# EAGLE board FamicomBox+ (EAGLE 9.6.2)
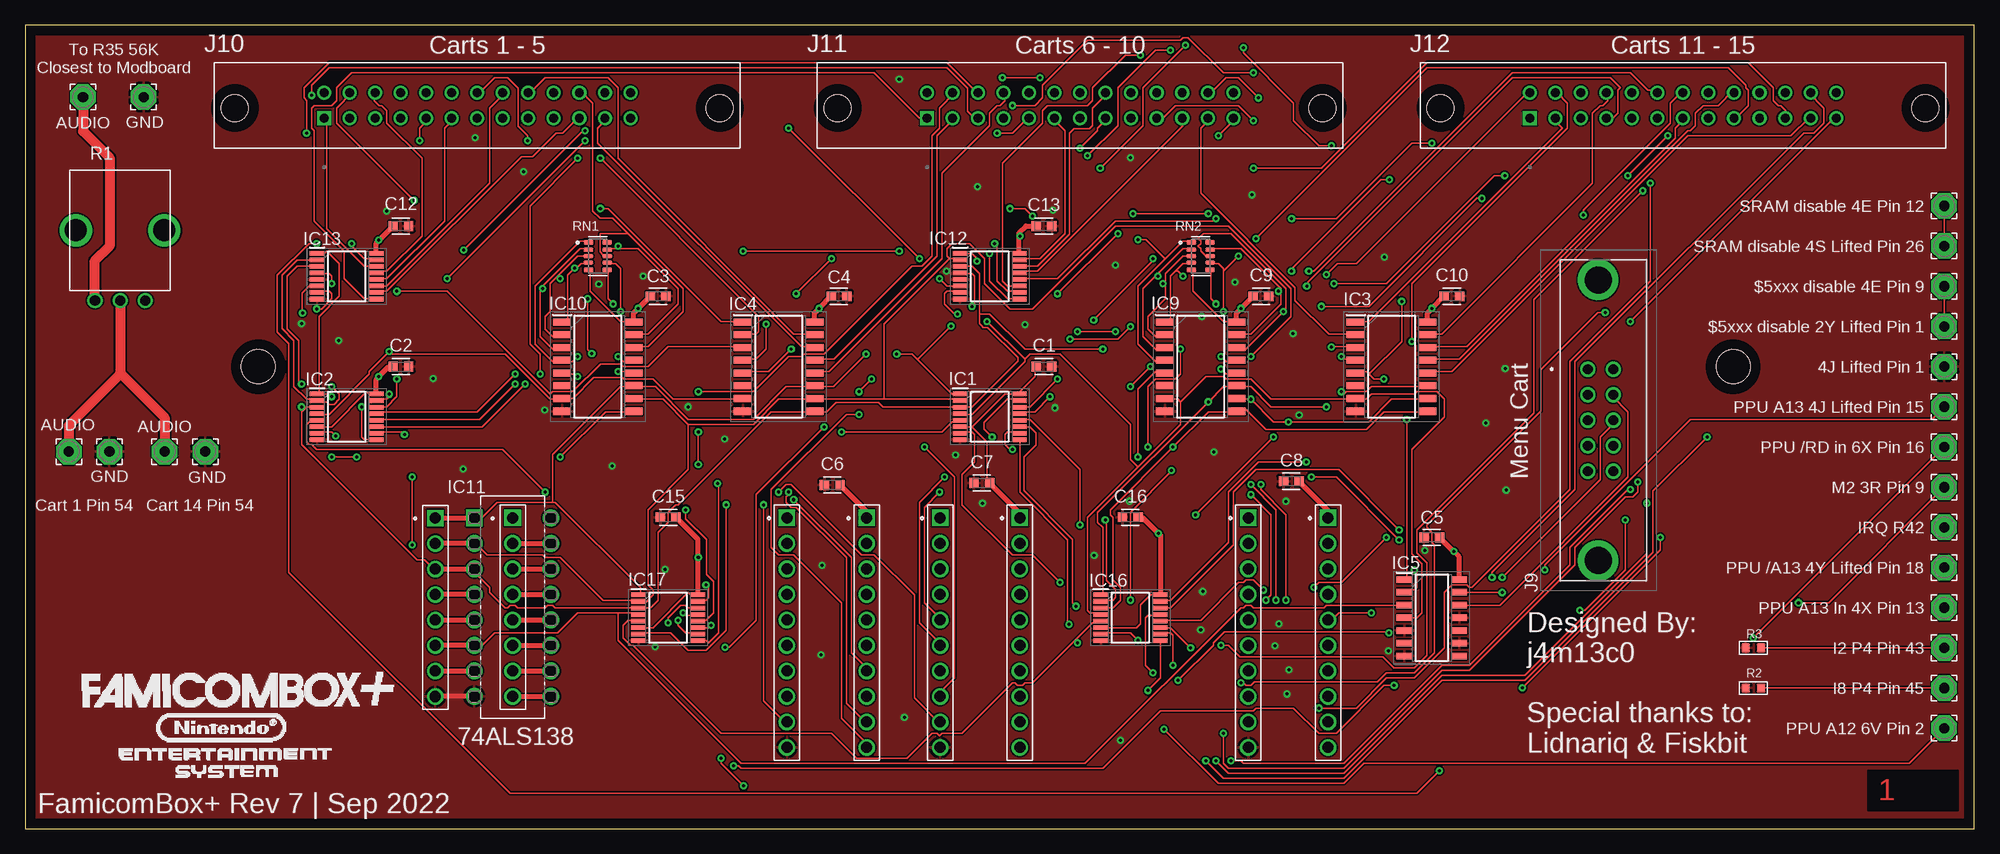
[diagram p1: board, top side]
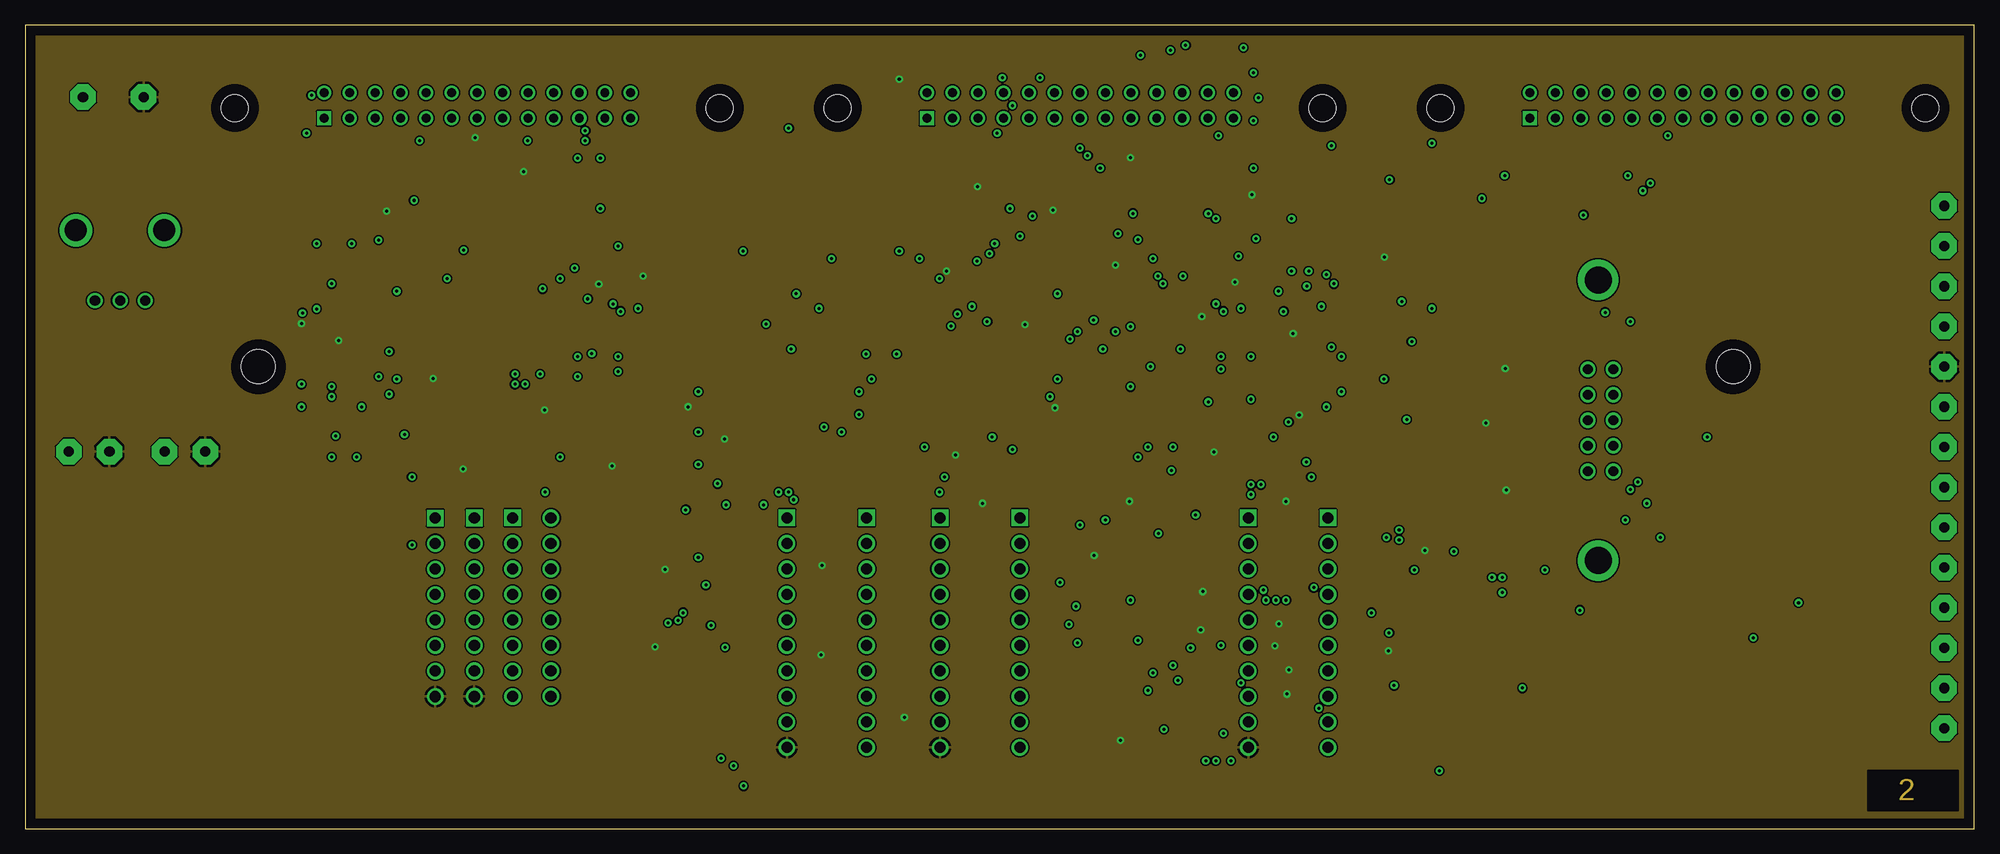
[diagram p2: board, inner layer Route2]
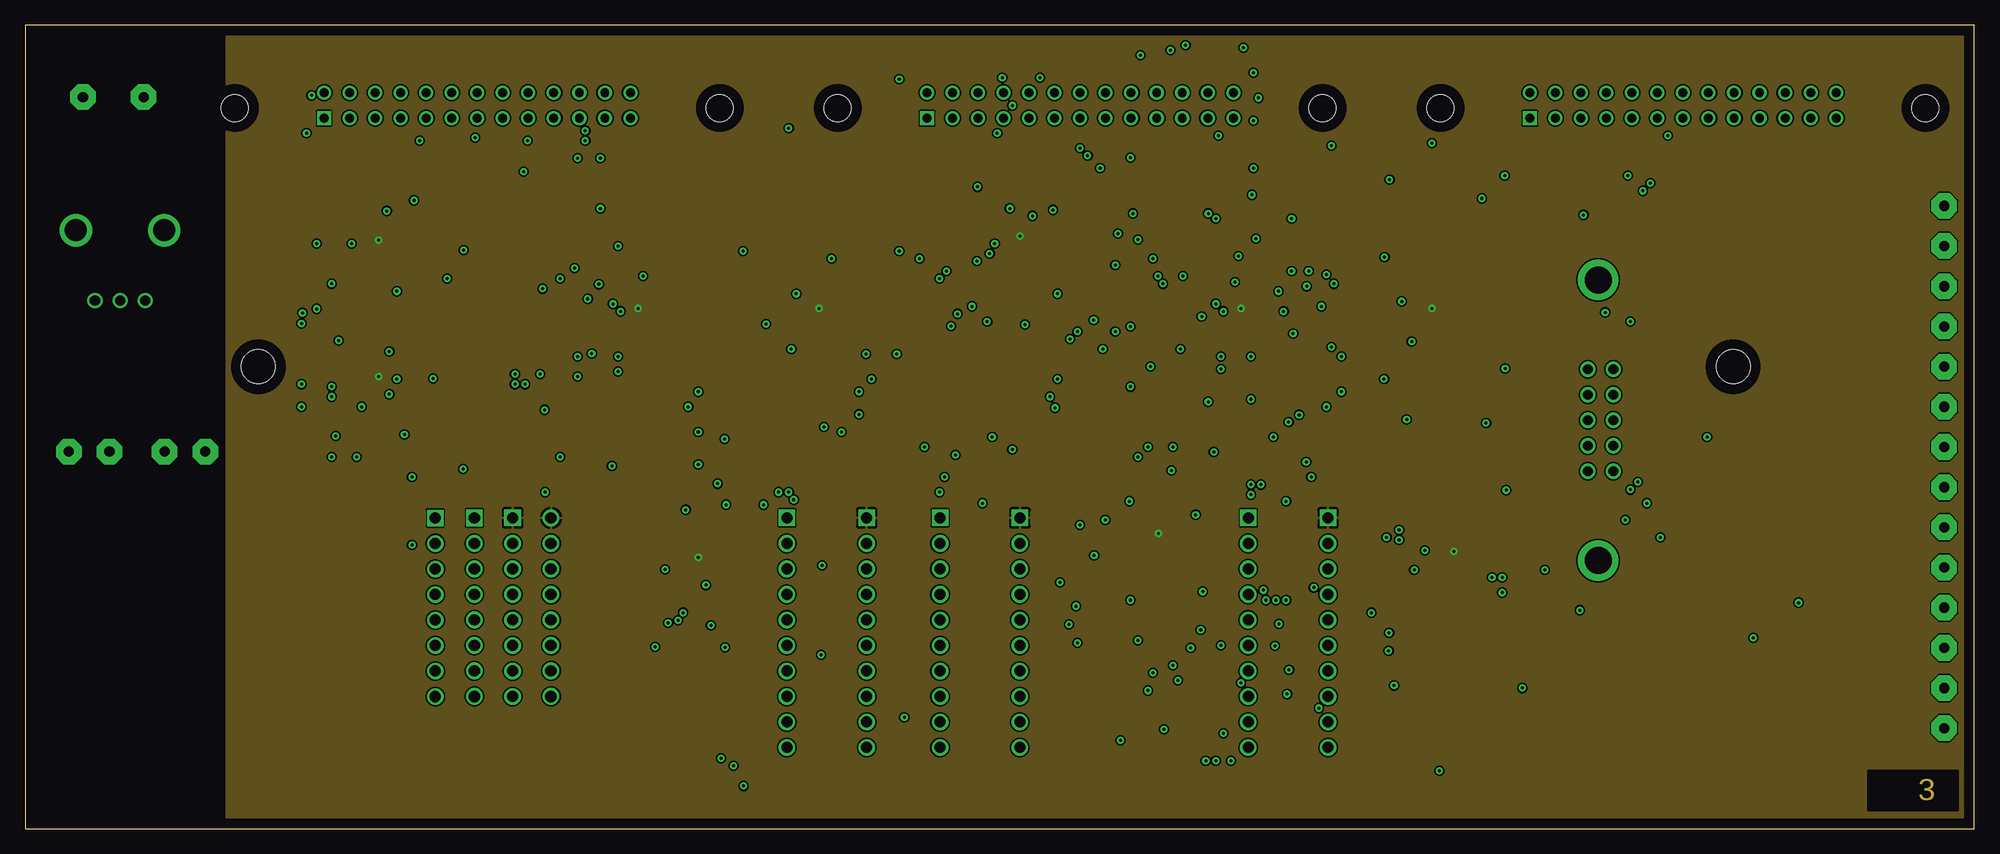
[diagram p3: board, inner layer Route15]
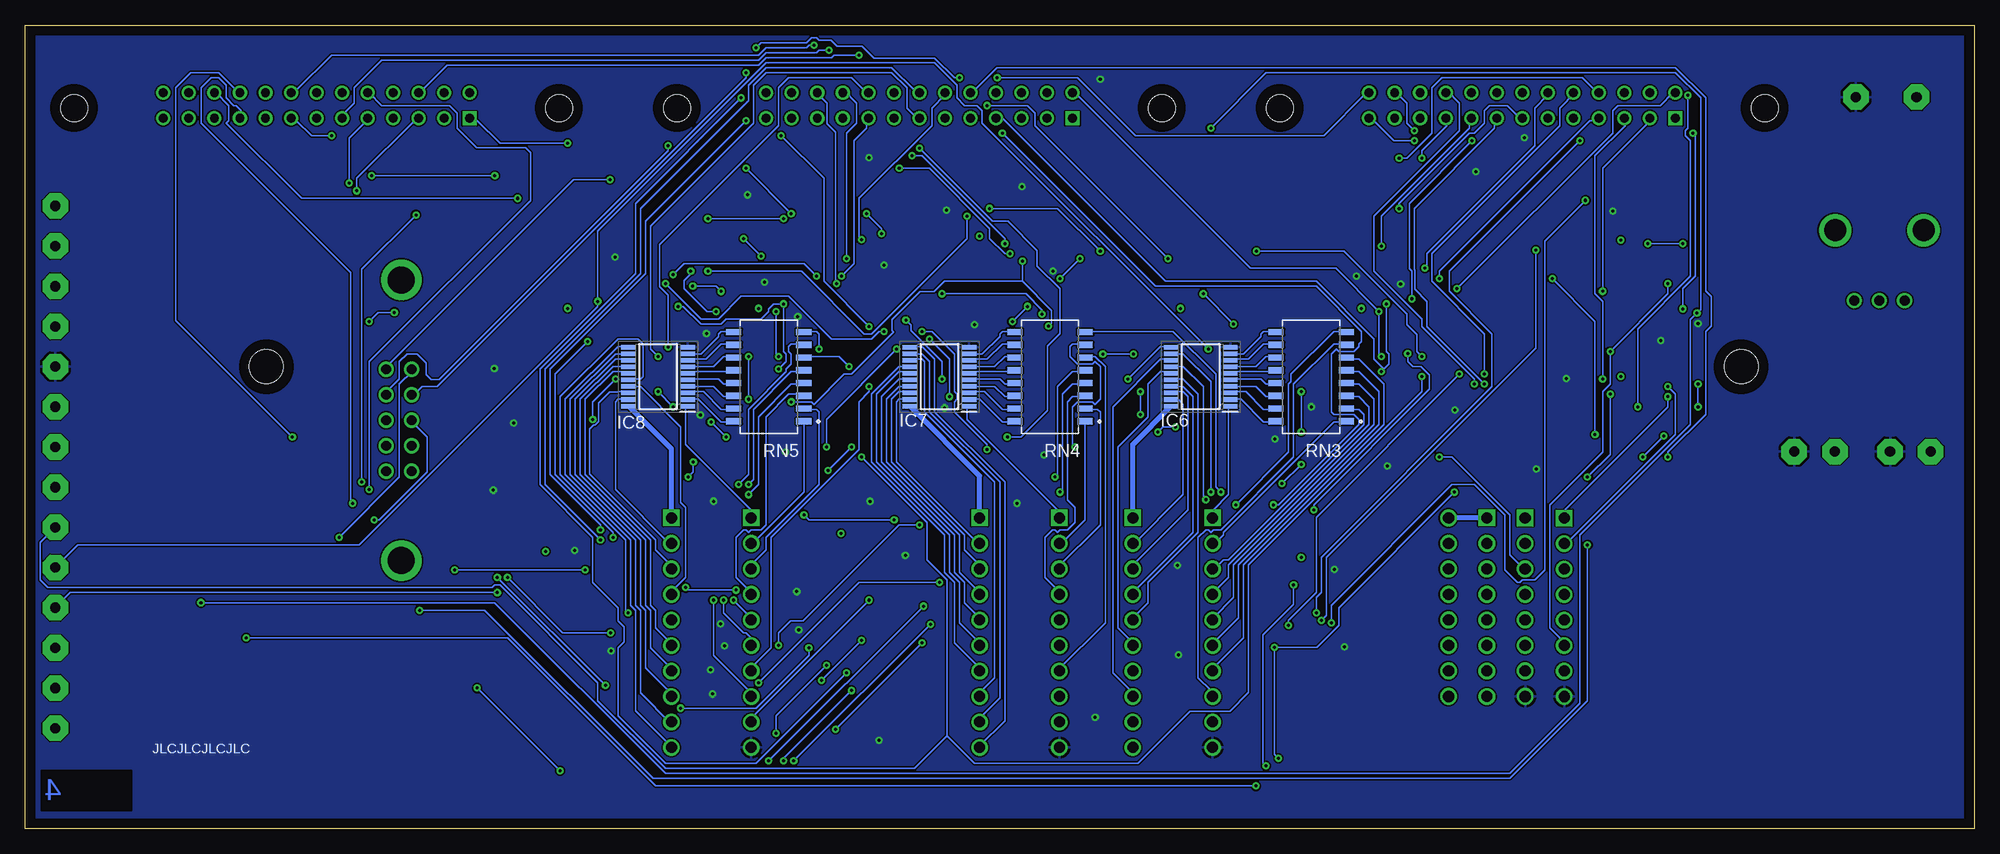
[diagram p4: board, bottom side, seen from below]

Size 194 x 80 mm. Coordinates in mm from the lower left corner, seen from the top.
Outline: 0,0 194,0 194,80 0,80 0,0
Copper layers (1*2+15*16): Top 0.035mm / dielectric 1.5mm / Route2 0.035mm / dielectric 0.15mm / Route15 0.035mm / dielectric 0.2mm / Bottom 0.035mm
Design rules "default *": minimum track width 6mil, minimum drill 0.3mm, track to track 6mil, track to pad 6mil, pad to pad 6mil, via to via 6mil, smd to smd 6mil, copper to edge 40mil, drill to drill 6mil, minimum pad ring 10mil, minimum via ring 8mil, stop-mask expansion 4mil, vias tented up to drill 0.3mm, thermal gap 10mil
Holes 3.4 mm at 23.2,46 170,46

## Footprints (pad centres in the part's own frame; a part is rotated, then mirrored left to right if it is on the bottom)
CAPC1608X85 = smd 0.921 x 0.97: 1 -0.775,0; 2 0.775,0
SOP65P640X110-16N = smd 1.475 x 0.45: 1 -2.938,2.275; 2 -2.938,1.625; 3 -2.938,0.975; 4 -2.938,0.325; 5 -2.938,-0.325; 6 -2.938,-0.975; 7 -2.938,-1.625; 8 -2.938,-2.275; 9 2.938,-2.275; 10 2.938,-1.625; 11 2.938,-0.975; 12 2.938,-0.325; 13 2.938,0.325; 14 2.938,0.975; 15 2.938,1.625; 16 2.938,2.275
SOIC127P780X200-16N = smd 1.825 x 0.7: 1 -3.562,4.445; 2 -3.562,3.175; 3 -3.562,1.905; 4 -3.562,0.635; 5 -3.562,-0.635; 6 -3.562,-1.905; 7 -3.562,-3.175; 8 -3.562,-4.445; 9 3.562,-4.445; 10 3.562,-3.175; 11 3.562,-1.905; 12 3.562,-0.635; 13 3.562,0.635; 14 3.562,1.905; 15 3.562,3.175; 16 3.562,4.445
SOIC127P600X175-14N = smd 1.55 x 0.65: 1 -2.725,3.81; 2 -2.725,2.54; 3 -2.725,1.27; 4 -2.725,0; 5 -2.725,-1.27; 6 -2.725,-2.54; 7 -2.725,-3.81; 8 2.725,-3.81; 9 2.725,-2.54; 10 2.725,-1.27; 11 2.725,0; 12 2.725,1.27; 13 2.725,2.54; 14 2.725,3.81
SOP65P640X120-20N = smd 1.475 x 0.45: 1 -2.938,2.925; 2 -2.938,2.275; 3 -2.938,1.625; 4 -2.938,0.975; 5 -2.938,0.325; 6 -2.938,-0.325; 7 -2.938,-0.975; 8 -2.938,-1.625; 9 -2.938,-2.275; 10 -2.938,-2.925; 11 2.938,-2.925; 12 2.938,-2.275; 13 2.938,-1.625; 14 2.938,-0.975; 15 2.938,-0.325; 16 2.938,0.325; 17 2.938,0.975; 18 2.938,1.625; 19 2.938,2.275; 20 2.938,2.925
DIP254P762X508-16 = drill 1.118 pad 1.676 square: 1 -7.62,17.78 | drill 1.118 pad 1.676: 2 -7.62,15.24; 3 -7.62,12.7; 4 -7.62,10.16; 5 -7.62,7.62; 6 -7.62,5.08; 7 -7.62,2.54; 8 -7.62,0; 9 0,0; 10 0,2.54; 11 0,5.08; 12 0,7.62; 13 0,10.16; 14 0,12.7; 15 0,15.24; 16 0,17.78
SOP65P640X120-16N = smd 1.475 x 0.45: 1 -2.938,2.275; 2 -2.938,1.625; 3 -2.938,0.975; 4 -2.938,0.325; 5 -2.938,-0.325; 6 -2.938,-0.975; 7 -2.938,-1.625; 8 -2.938,-2.275; 9 2.938,-2.275; 10 2.938,-1.625; 11 2.938,-0.975; 12 2.938,-0.325; 13 2.938,0.325; 14 2.938,0.975; 15 2.938,1.625; 16 2.938,2.275
61300811121 = drill 1.1 square: 1 -8.89,0 | drill 1.1: 2 -6.35,0; 3 -3.81,0; 4 -1.27,0; 5 1.27,0; 6 3.81,0; 7 6.35,0; 8 8.89,0
61301011121 = drill 1.1 square: 1 -11.43,0 | drill 1.1: 2 -8.89,0; 3 -6.35,0; 4 -3.81,0; 5 -1.27,0; 6 1.27,0; 7 3.81,0; 8 6.35,0; 9 8.89,0; 10 11.43,0
254992061 = drill 0.97 pad 1.509: 1 0,0; 2 0,2.54; 3 2.54,0; 4 2.54,2.54; 5 5.08,0; 6 5.08,2.54; 7 7.62,0; 8 7.62,2.54; 9 10.16,0; 10 10.16,2.54 | drill 2.69 pad 4.035: MH1 -8.89,1.02; MH2 19.05,1.02
TE_2-5499206-6 = drill 0.89 square: 1 -15.24,-1.27 | drill 0.89: 2 -15.24,1.27; 3 -12.7,-1.27; 4 -12.7,1.27; 5 -10.16,-1.27; 6 -10.16,1.27; 7 -7.62,-1.27; 8 -7.62,1.27; 9 -5.08,-1.27; 10 -5.08,1.27; 11 -2.54,-1.27; 12 -2.54,1.27; 13 0,-1.27; 14 0,1.27; 15 2.54,-1.27; 16 2.54,1.27; 17 5.08,-1.27; 18 5.08,1.27; 19 7.62,-1.27; 20 7.62,1.27; 21 10.16,-1.27; 22 10.16,1.27; 23 12.7,-1.27; 24 12.7,1.27; 25 15.24,-1.27; 26 15.24,1.27 | hole 2.69: -24.13,-0.25; 24.13,-0.25
2,54/1,0 = drill 1.016 pad 2.54 octagon: 1 0,0
PTV09 = drill 1: 1 -2.5,0; 2 0,0; 3 2.5,0 | drill 2.2: NC1 -4.4,7; NC2 4.4,7
R0603 = smd 0.889 x 0.889: 1 0,0.762; 2 0,-0.762
RESCAXS64P320X160X60-10N = smd 0.97 x 0.54: 1 -0.94,1.365; 5 -0.94,-1.365; 6 0.94,-1.365; 10 0.94,1.365 | smd 0.97 x 0.37: 2 -0.94,0.64; 3 -0.94,0; 4 -0.94,-0.64; 7 0.94,-0.64; 8 0.94,0; 9 0.94,0.64
SOIC127P762X240-16N = smd 1.59 x 0.6: 1 -3.495,4.445; 2 -3.495,3.175; 3 -3.495,1.905; 4 -3.495,0.635; 5 -3.495,-0.635; 6 -3.495,-1.905; 7 -3.495,-3.175; 8 -3.495,-4.445; 9 3.495,-4.445; 10 3.495,-3.175; 11 3.495,-1.905; 12 3.495,-0.635; 13 3.495,0.635; 14 3.495,1.905; 15 3.495,3.175; 16 3.495,4.445

## Placement (x,y rotation side)
C1  100nF  [CAPC1608X85]  101.4,46 180 top
C2  100nF  [CAPC1608X85]  37.4,46 180 top
C3  100nF  [CAPC1608X85]  63,53 180 top
C4  100nF  [CAPC1608X85]  81,53 180 top
C5  100nF  [CAPC1608X85]  140,29 0 top
C6  100nF  [CAPC1608X85]  80.32,34.23 0 top
C7  100nF  [CAPC1608X85]  95.22,34.41 0 top
C8  100nF  [CAPC1608X85]  126.02,34.59 0 top
C9  100nF  [CAPC1608X85]  123,53 180 top
C10  100nF  [CAPC1608X85]  142,53 180 top
C12  100nF  [CAPC1608X85]  37.4,60 180 top
C13  100nF  [CAPC1608X85]  101.4,60 180 top
C15  100nF  [CAPC1608X85]  64,31 0 top
C16  100nF  [CAPC1608X85]  110,31 0 top
IC1  74HC138PW,118  [SOP65P640X110-16N]  96,41 0 top
IC2  74HC138PW,118  [SOP65P640X110-16N]  32,41 0 top
IC3  SN74HC251NSR  [SOIC127P780X200-16N]  136,46 0 top
IC4  SN74HC251NSR  [SOIC127P780X200-16N]  75,46 0 top
IC5  MC74HC04ADG  [SOIC127P600X175-14N]  140,21 0 top
IC6  SN74CBT3245APWR  [SOP65P640X120-20N]  77,45 180 bottom
IC7  SN74CBT3245APWR  [SOP65P640X120-20N]  103,45 180 bottom
IC8  SN74CBT3245APWR  [SOP65P640X120-20N]  131,45 180 bottom
IC9  SN74HC251NSR  [SOIC127P780X200-16N]  117,46 0 top
IC10  SN74HC251NSR  [SOIC127P780X200-16N]  57,46 0 top
IC11  SN74ALS138AN  [DIP254P762X508-16]  52.33,13.16 0 top
IC12  CD74HC238PWR  [SOP65P640X120-16N]  96,55 0 top
IC13  CD74HC238PWR  [SOP65P640X120-16N]  32,55 0 top
IC16  74HC138PW,118  [SOP65P640X110-16N]  110,21 0 top
IC17  74HC138PW,118  [SOP65P640X110-16N]  64,21 0 top
J1  61300811121  [61300811121]  40.82,22.04 270 top
J2  61300811121  [61300811121]  48.52,22.05 270 top
J3  61301011121  [61301011121]  75.82,19.51 270 top
J4  61301011121  [61301011121]  83.76,19.51 270 top
J5  61301011121  [61301011121]  91.06,19.51 270 top
J6  61301011121  [61301011121]  99,19.51 270 top
J7  61301011121  [61301011121]  121.74,19.51 270 top
J8  61301011121  [61301011121]  129.68,19.51 270 top
J9  2-5499206-1  [254992061]  155.54,45.74 270 top
J10  2-5499206-6  [TE_2-5499206-6]  45,72 0 top
J11  2-5499206-6  [TE_2-5499206-6]  105,72 0 top
J12  2-5499206-6  [TE_2-5499206-6]  165,72 0 top
PAD1  WIREPAD2,54/1,0  [2,54/1,0]  191,46 0 top
PAD2  WIREPAD2,54/1,0  [2,54/1,0]  191,34 0 top
PAD3  WIREPAD2,54/1,0  [2,54/1,0]  191,30 0 top
PAD4  WIREPAD2,54/1,0  [2,54/1,0]  191,26 0 top
PAD5  WIREPAD2,54/1,0  [2,54/1,0]  191,42 0 top
PAD6  WIREPAD2,54/1,0  [2,54/1,0]  191,22 0 top
PAD7  WIREPAD2,54/1,0  [2,54/1,0]  191,18 0 top
PAD8  WIREPAD2,54/1,0  [2,54/1,0]  191,14 0 top
PAD9  WIREPAD2,54/1,0  [2,54/1,0]  191,62 0 top
PAD10  WIREPAD2,54/1,0  [2,54/1,0]  191,58 0 top
PAD11  WIREPAD2,54/1,0  [2,54/1,0]  191,54 0 top
PAD12  WIREPAD2,54/1,0  [2,54/1,0]  191,50 0 top
PAD13  WIREPAD2,54/1,0  [2,54/1,0]  191,38 0 top
PAD14  WIREPAD2,54/1,0  [2,54/1,0]  11.79,72.83 0 top
PAD15  WIREPAD2,54/1,0  [2,54/1,0]  5.76,72.83 0 top
PAD16  WIREPAD2,54/1,0  [2,54/1,0]  4.34,37.54 0 top
PAD17  WIREPAD2,54/1,0  [2,54/1,0]  13.88,37.54 0 top
PAD18  WIREPAD2,54/1,0  [2,54/1,0]  17.93,37.54 0 top
PAD19  WIREPAD2,54/1,0  [2,54/1,0]  8.39,37.54 0 top
PAD20  WIREPAD2,54/1,0  [2,54/1,0]  191,10 0 top
R1  PTV09A-4020F-A504  [PTV09]  9.45,52.58 0 top
R2  1.5K  [R0603]  172,14 270 top
R3  1.5K  [R0603]  172,18 270 top
RN1  CAY17-103JALF  [RESCAXS64P320X160X60-10N]  57,57 0 top
RN2  CAY17-103JALF  [RESCAXS64P320X160X60-10N]  117,57 0 top
RN3  4816P-1-562LF  [SOIC127P762X240-16N]  66,45 180 bottom
RN4  4816P-1-562LF  [SOIC127P762X240-16N]  92,45 180 bottom
RN5  4816P-1-562LF  [SOIC127P762X240-16N]  120,45 180 bottom

## Tracks (layer width: path | path; a pad name or v marks a point on that pad's centre or on a via)
/CAS3  (via drill 0.3)
  Top 0.152: IC5.4 138.5,21 139,21.5 139,26.35 138,27.35 138,37.75 141.25,41 141.25,42.75 140.5,43.5 138.5,43.5 138.25,43.25 134,43.25 133.5,42.75 132.5,42.75 IC3.7 132.25,42.75 124,42.75 122,44.75 119.5,44.75 119.25,45 117.5,45 115,42.5 | 110.75,36 115,40.25 115,42.5 | 110.75,36 105.75,31 105.75,21.75 106,21.5 107,21.5 IC16.4 | 115,42.5 114.75,42.75 113.5,42.75 IC9.7 | 99.5,46.75 99.5,46.5 94.25,41.25 93.25,41.25 IC1.4 | 99.5,46.75 100,47.25 103,47.25 110,40.25 110,36.75 110.75,36 | v94.25,52 94.5,52.25 94.5,55 94.25,55.25 93.25,55.25 IC12.4 | 99.5,46.75 v95.75,50.5
  Bottom 0.152: v95.75,50.5 v94.25,52
CAS0  (via drill 0.3)
  Top 0.152: IC16.1 107.25,23.25 107.25,30 106.75,30.5 106.75,31.5 v117.75,42.5 119.25,44 120.5,44 IC9.11 120.75,44 122,44 124,42 v129.5,42 | v131,43.5 131.25,43.25 131.5,43.5 133.5,43.5 134,44 139.5,44 IC3.11 | 88.8,46.7 88.25,47.25 v86.75,47.25 | 88.8,46.7 92.25,43.25 93,43.25 IC1.1 | v83.7,47.25 80.45,44 78.75,44 IC4.11 78.5,44 75.75,44 72.5,40.75 66,40.75 62.75,44 60.75,44 IC10.11 60.5,44 59.25,44 52.5,37.25 52.5,32.5 | v94.75,56.5 94.75,56.75 94.25,57.25 93.25,57.25 IC12.1 | 88.8,46.7 v92.15,50.05 | 29.25,43.25 29.25,51 31.25,53 31.25,56.25 30,57.5 29.75,57.25 29.25,57.25 IC13.1 | 52.5,32.5 47,32.5 45.5,31 44.75,31 IC11.1 | 52.5,32.5 52.75,32.5 61.25,24 61.25,23.25 IC17.1 | 29.25,43.25 30.25,43.25 v30.5,43 | 29.25,43.25 IC2.1
  Top 0.508: J1.1 IC11.1
  Bottom 0.152: v129.5,42 v131,43.5 | v83.7,47.25 v86.75,47.25 | 94.75,54.5 v94.75,56.5 | 94.75,54.5 91.85,51.6 91.85,50.35 v92.15,50.05 | v30.5,43 30.5,42 40.75,31.75 40.75,31 J1.1 | v117.75,42.5 115.75,42.5 115.5,42.25 112.5,45.25 111.75,45.25 107.55,49.45 107.7,49.6 107.7,50.7 104.95,53.45 103.55,53.45 102.5,54.5 94.75,54.5
CAS1  (via drill 0.3)
  Top 0.152: v124.25,39 v116.5,31.25 | IC16.2 107.25,22.75 108.25,22.75 108.5,23 108.5,23.8 107.6,24.7 107.6,30.65 v107.5,30.75 | IC9.10 120.75,42.75 v122,42.75 124.25,40.5 v125.75,40.5 133.75,40.5 136,42.75 139.5,42.75 IC3.10 | 85.5,42.75 78.75,42.75 IC4.10 78.5,42.75 75,42.75 72.5,40.25 66,40.25 | 85.5,42.75 93,42.75 IC1.2 | 92,56.75 93,56.75 IC12.2 | 92,56.75 85.5,50.25 85.5,42.75 | 66,40.25 63.5,42.75 60.75,42.75 IC10.10 | IC11.2 44.75,28.5 46,27.25 51.5,27.25 51.75,27 53.25,27 57.5,22.75 61,22.75 IC17.2 61.25,22.5 61.75,22.5 62.5,23.25 62.5,23.75 62,24.25 62,31.75 66,35.75 66,40.25 | v30.5,44 31.25,43.25 31.25,42.75 30.75,42.25 30.25,42.25 30,42.5 29.25,42.5 IC2.2 29,42.75 28,42.75 26.75,44 26.75,48.6 25.57,49.78 25.57,55.13 27.06,56.62 IC13.2 | v122,47 126,51 126,53.75 119.75,60 108.5,60 100.25,51.75 98,51.75 95.5,54.25 95.5,56.75 94,58.25 92.25,58.25 91.75,57.75 91.75,57 92,56.75
  Top 0.508: IC11.2 J1.2
  Bottom 0.152: v107.5,30.75 116,30.75 v116.5,31.25 | v125.75,40.5 v124.25,39 | v30.5,44 29.75,43.25 29.75,39.25 40.75,28.25 J1.2 | v122,47 v122,42.75
CAS2  (via drill 0.3)
  Top 0.152: IC16.3 107.25,22 108.25,22 109,22.75 109,24 108.25,24.75 108.25,31 108,31.25 108,31.75 v114.25,38 117.75,41.5 120.5,41.5 IC9.9 120.75,41.75 121.5,41.75 123.5,39.75 133.5,39.75 135.25,41.5 139.5,41.5 IC3.9 | 95,51.25 95,50.3 95.3,50 95.3,49.9 95.8,49.9 98.8,46.9 98.8,46.55 94.25,42 93.25,42 IC1.3 93,42 85.4,42 84.95,42.44 80.69,42.44 79.75,41.5 78.75,41.5 IC4.9 78.5,41.5 74.25,41.5 65,32.25 64.75,32.25 64,31.5 64,30.5 63,29.5 63,22.75 62.25,22 61.25,22 IC17.3 61,22 52.75,22 52.5,22.25 52,22.25 51.75,22 49,22 48.75,22.25 48.25,22.25 48,22 47.75,22 46.25,23.5 46.25,24 44.5,25.75 IC11.3 | 95,51.25 95,55.25 94.25,56 93.25,56 IC12.3 | 27.75,41.75 27.5,41.5 27.5,38.25 39,26.75 39.75,26.75 40.75,25.75 J1.3 | 27.75,41.75 28,42 29,42 IC2.3 | v27.5,44.25 27.25,44.5 27.25,48.6 26.1,49.75 26.1,55 27.1,56 29,56 IC13.3 | 27.75,41.75 v27.5,42 | v53.25,37 57.75,41.5 60.5,41.5 IC10.9 | v107.25,47.75 99.5,47.75 96,51.25 95,51.25
  Top 0.508: J1.3 IC11.3
  Bottom 0.152: v27.5,42 v27.5,44.25 | v53.25,37 52,37 46.25,31.25 46.25,27.25 44.75,25.75 IC11.3 | v114.25,38 114.25,40.75 v107.25,47.75
CAS3  (via drill 0.3)
  Top 0.152: 36.25,47.25 47.75,47.25 52.25,42.75 53.25,42.75 IC10.7 54.52,42.83 56.6,44.9 59.44,44.9 59.59,44.75 62.5,44.75 64.5,42.75 71.25,42.75 IC4.7 | 36.25,47.25 36,47.25 34.25,45.5 34.25,45.25 30.25,41.25 29.25,41.25 IC2.4 | v30.5,54.25 30.5,55 30.25,55.25 29.25,55.25 IC13.4 | 36.25,47.25 v36.25,47.5 | 59,21.5 55,21.5 53,19.5 46.75,19.5 45.5,18.25 44.75,18.25 IC11.6 | 59,21.5 61,21.5 IC17.4 | 59,21.5 59,18.75 71.25,6.5 105.5,6.5 121,22 121.25,22 121.5,22.25 122,22.25 122.25,22 129.25,22 129.5,22.25 137.25,22.25 IC5.3
  Top 0.508: IC11.6 J1.6
  Bottom 0.152: v30.5,54.25 30.5,53.25 v36.25,47.5 36.25,44.25 37,43.5 37,37.5 42.25,32.25 42.25,20 41,18.75 41,18.25 J1.6
CUTOUT
  cutout Top: 183.4,5.8 183.4,1.8 192.4,1.8 192.4,5.8
  cutout Route2: 183.4,5.8 183.4,1.8 192.4,1.8 192.4,5.8
  cutout Route15: 183.4,5.8 183.4,1.8 192.4,1.8 192.4,5.8
  cutout Bottom: 183.4,5.8 183.4,1.8 192.4,1.8 192.4,5.8
GND  (via drill 0.3)
  Top 0.508: IC11.8 J1.8
  other vias: 106.4,27.2 117.2,23.6 117,19.8 109,8.8 125.6,13.4 125.8,15.8 124.4,18.2 124.8,20.4 147.3,45.8 145.4,40.4 147.4,33.7 122.1,63.1 94.8,63.9 87,74.6 49.6,65.4 57.1,54.2 58.4,36.1 43.6,35.8 40.6,44.8 31.2,48.6 87.5,11.1 79.2,17.3 63.7,25.8 79.3,26.2 91.7,55.5 108.5,56.1 102.5,41.9 92.6,37.2 139.3,27.7 99.5,50.2 95.3,32.4 27.5,50.3 126.2,49.3 125.5,32.6 36,61.5 126.8,41.2 69.6,38.8 62.7,18.1 102.3,61.6 51.7,41.7 61.5,55 109.9,32.6 120.4,54.4 66,42 135.3,56.9 110,66.8 118.3,37.5 135.7,17.7 117.1,51 44.8,68.8
  pour Top: 0.3,79.7 193.7,79.7 193.7,0.3 0.3,0.3
  pour Bottom: 0.3,79.7 193.7,79.7 193.7,0.3 0.3,0.3
  pour Route2: 0.3,79.7 193.7,79.7 193.7,0.3 0.3,0.3
IRQ_OUT  (via drill 0.3)
  Top 0.152: v55,45 54.75,45.25 53.5,45.25 IC10.5 | v110.75,37 110.75,43.75 112.5,45.5 113.25,45.5 IC9.5
  Bottom 0.152: v55,45 55,43.5 72.25,26.25 72.25,13.55 74.1,11.7 78.05,11.7 83.25,6.5 99.5,6.5 102.25,9.25 | 102.25,9.25 102.25,24.75 104.25,26.75 104.25,30.5 v110.75,37 | PAD3.1 192.5,28.5 192.5,24.75 191.75,24 147.5,24 147.25,24.25 146.75,24.25 137,14.5 137,12.75 130.25,6 105.5,6 102.25,9.25
M2_IN  (via drill 0.3)
  Top 0.152: v27.6,51.35 27.55,51.4 27.55,53.3 28.25,54 29,54 IC13.6 | v89,56.75 v76,69.75 | v91,54.75 91.75,54 93,54 IC12.6 | PAD2.1 179.5,22.5 v176.5,22.5
  Bottom 0.152: v76,69.75 70.5,75.25 29.75,75.25 27.25,72.75 27.25,51.7 v27.6,51.35 28.25,50.7 28.25,40.25 39.25,29.25 39.25,12.5 46.25,5.5 130.25,5.5 147.25,22.5 v176.5,22.5 | v91,54.75 v89,56.75
N$1
  Bottom 0.152: IC6.2 74,42.75 73,42.75 70.75,40.5 69.5,40.5 RN3.16
N$2
  Bottom 0.152: IC6.3 74,43.5 72.5,43.5 70.75,41.75 69.5,41.75 RN3.15
N$3
  Bottom 0.152: IC6.4 74,44 71.5,44 70.5,43 69.5,43 RN3.14
N$4
  Bottom 0.152: IC6.5 74,44.75 71,44.75 70.5,44.25 69.5,44.25 RN3.13
N$5
  Bottom 0.152: IC6.6 74,45.5 69.5,45.5 RN3.12
N$6
  Bottom 0.152: IC6.7 74,46 71.5,46 70.5,47 69.5,47 RN3.11
N$7
  Bottom 0.152: IC6.8 74,46.75 72.25,46.75 70.75,48.25 69.5,48.25 RN3.10
N$8
  Bottom 0.152: IC6.9 74,47.25 72.75,47.25 71,49 71,49.25 70.75,49.5 69.5,49.5 RN3.9
N$9
  Bottom 0.152: RN3.1 62.75,40.5 63.75,40.5 74.75,29.5 74.75,29.25 75.75,28.25 J3.2
N$10
  Bottom 0.152: RN3.2 62.5,41.75 61.25,41.75 60.75,41.25 60.75,40.25 74.25,26.75 74.75,26.75 75.75,25.75 J3.3
N$11  (via drill 0.3)
  Top 0.152: v83,43.5 v84.25,44.75 | v83,41.25 81.75,41.25 74.25,33.75 74.25,28 75,27.25 76.5,27.25 81.25,22.5 81.25,11 84,8.25 J4.10
  Bottom 0.152: v84.25,44.75 81,48 80,48 IC6.11 | v83,41.25 v83,43.5
N$12  (via drill 0.3)
  Top 0.152: v76,33.5 76,33.25 75.75,33 75.75,32.5 76.25,32 76.75,32 81.75,27 81.75,12.5 83.75,10.5 J4.9
  Bottom 0.152: v76,33.5 76,44.5 78.75,47.25 79.75,47.25 IC6.12
N$13
  Bottom 0.152: IC6.13 80,46.75 81,46.75 85.75,42 85.75,15.5 84,13.75 84,13.25 J4.8
N$14  (via drill 0.3)
  Top 0.152: v76.5,32.75 82.25,27 82.25,17.5 84,15.75 J4.7
  Bottom 0.152: v76.5,32.75 76.75,33 76.75,44 78.75,46 79.75,46 IC6.14
N$15
  Bottom 0.152: IC6.15 80,45.5 81,45.5 82.25,44.25 82.25,41 85.25,38 85.25,20 84,18.75 84,18.25 J4.6
N$16
  Bottom 0.152: IC6.16 79.75,44.75 78.75,44.75 77.25,43.25 77.25,29.5 82.25,24.5 82.25,22.5 83.75,21 J4.5
N$17
  Bottom 0.152: IC6.17 79.75,44 78.75,44 77.75,43 77.75,29.5 83.75,23.5 J4.4
N$18
  Bottom 0.152: IC6.18 79.75,43.5 78.75,43.5 78.25,43 78.25,31.75 84,26 J4.3
N$19
  Bottom 0.152: IC6.19 79.75,42.75 79.25,42.75 78.75,42.25 78.75,33.25 83.75,28.25 J4.2
N$20
  Bottom 0.152: RN3.3 62.5,43 61.25,43 60.25,42 60.25,40.25 74.25,26.25 74.25,25 75.75,23.5 J3.4
N$21
  Bottom 0.152: RN3.4 62.5,44.25 61.25,44.25 59.75,42.75 59.75,40.25 73.75,26.25 73.75,23 75.75,21 J3.5
N$22
  Bottom 0.152: RN3.5 62.5,45.5 61.25,45.5 59.25,43.5 59.25,40.25 73.25,26.25 73.25,21 76,18.25 J3.6
N$23
  Bottom 0.152: RN3.6 62.5,46.75 61.25,46.75 58.75,44.25 58.75,40.25 72.75,26.25 72.75,19 76,15.75 J3.7
N$24
  Bottom 0.152: RN3.7 62.75,48.25 63.75,48.25 67.75,44.25 67.75,37 75,29.75 75.75,29.75 76,29.5 76.25,29.75 76.5,29.75 77.25,29 77.25,15 76,13.75 76,13.25 J3.8
N$25  (via drill 0.3)
  Top 0.152: v73.5,32.25 73.5,12.75 75.75,10.5 J3.9
  Bottom 0.152: v73.5,32.25 68.25,37.5 68.25,44.25 68,44.5 68,45.25 63.75,49.5 62.75,49.5 RN3.8
N$26
  Bottom 0.152: IC6.1 74.25,42 74.25,33.25 75.75,31.75 75.75,31 J3.1
N$27
  Bottom 0.152: RN5.1 116.5,40.5 116.5,33.5 121.5,28.5 J7.2
N$29
  Bottom 0.152: IC7.11 105.75,48 104.75,48 103.5,46.75 103.5,41.5 96.5,34.5 96.5,10.75 99,8.25 J6.10
N$30
  Bottom 0.152: J6.9 99,11 97,13 97,34.5 104,41.5 104,46.5 104.75,47.25 105.75,47.25 IC7.12
N$31
  Bottom 0.152: J6.8 99,13.5 97.5,15 97.5,34.5 104.5,41.5 104.5,46.5 104.75,46.75 105.75,46.75 IC7.13
N$32
  Bottom 0.152: J6.7 99,16 101.5,18.5 101.5,24.5 102.5,25.5 102.5,29.25 109.75,36.5 109.75,43.25 107,46 106,46 IC7.14
N$33
  Bottom 0.152: J6.6 99,18.5 101,20.5 101,24.5 102,25.5 102,29.25 109.25,36.5 109.25,43.25 107,45.5 106,45.5 IC7.15
N$34
  Bottom 0.152: IC7.16 106,44.75 107,44.75 108.75,43 108.75,36.5 101.5,29.25 101.5,25.5 100.5,24.5 100.5,22.5 99,21 J6.5
N$35
  Bottom 0.152: IC7.17 106,44 107,44 108.25,42.75 108.25,36.5 101,29.25 101,25.5 99,23.5 J6.4
N$36
  Bottom 0.152: J6.3 99,26.25 100.5,27.75 100.5,29.25 107.75,36.5 107.75,42.75 107,43.5 106,43.5 IC7.18
N$37
  Bottom 0.152: IC7.19 106,42.75 107,42.75 107.25,42.5 107.25,36.5 99,28.25 J6.2
N$38
  Bottom 0.152: IC8.19 134,42.75 135,42.75 135.25,42.5 135.25,33.75 129.75,28.25 J8.2
N$39
  Bottom 0.152: IC8.18 134,43.5 135,43.5 135.05,43.45 135.85,43.45 136.9,42.4 136.9,40.53 137.26,40.17 137.43,40.17 137.8,39.8 137.8,35.3 131.25,28.75 131.25,27.75 129.5,26 J8.3
N$40
  Bottom 0.152: IC8.17 133.75,44 132.75,44 128.75,40 128.75,32.5 128.25,32 128.25,25 129.75,23.5 J8.4
N$41  (via drill 0.3)
  Top 0.152: v134,21.5 130.75,21.5 130.25,21 129.75,21 J8.5
  Bottom 0.152: v134,21.5 134.25,21.75 134.25,28.75 140.75,35.25 140.75,43 135,48.75 133,48.75 132.5,48.25 132.5,45 132.75,44.75 133.75,44.75 IC8.16
N$42
  Bottom 0.152: IC8.15 134,45.5 135.5,45.5 138.25,42.75 138.25,35.25 131.75,28.75 131.75,22.25 131.25,21.75 131.25,20 129.5,18.25 J8.6
N$43
  Bottom 0.152: IC8.14 134,46 135.5,46 138.75,42.75 138.75,35.25 132.25,28.75 132.25,22.25 131.75,21.75 131.75,18 129.5,15.75 J8.7
N$44
  Bottom 0.152: IC8.13 134,46.75 135.25,46.75 139.25,42.75 139.25,35.25 132.75,28.75 132.75,22.25 132.25,21.75 132.25,16 129.5,13.25 J8.8
N$45
  Bottom 0.152: IC8.12 134,47.25 135.25,47.25 139.75,42.75 139.75,35.25 133.25,28.75 133.25,22.25 132.75,21.75 132.75,13.5 129.75,10.5 J8.9
N$46
  Bottom 0.152: IC8.11 134,48 135,48 140.25,42.75 140.25,35.25 133.75,28.75 133.75,22.25 133.25,21.75 133.25,11.75 129.75,8.25 J8.10
N$47
  Bottom 0.152: IC7.5 100,44.75 97,44.75 96.5,44.25 95.5,44.25 RN4.13
N$48  (via drill 0.3)
  Top 0.152: v91,33.5 89.5,32 89.5,22.5 91,21 J5.5
  Bottom 0.152: v91,33.5 90.75,33.75 90.75,43.25 89.75,44.25 88.75,44.25 RN4.4
N$49
  Bottom 0.152: RN4.1 88.5,40.5 88.5,30.75 91,28.25 J5.2
N$50
  Bottom 0.152: RN4.2 88.5,41.75 87.25,41.75 87,41.5 87,30.25 91.25,26 J5.3
N$51
  Bottom 0.152: RN4.3 88.75,43 89.75,43 90.25,42.5 90.25,32.75 89.5,32 89.5,30.5 90.25,29.75 91,29.75 91.25,29.5 91.5,29.75 91.75,29.75 92.5,29 92.5,25 91,23.5 J5.4
N$52  (via drill 0.3)
  Top 0.152: v91.5,35 89,32.5 89,20.5 91.25,18.25 J5.6
  Bottom 0.152: v91.5,35 91.25,35.25 91.25,44 89.75,45.5 88.75,45.5 RN4.5
N$53
  Bottom 0.152: RN4.6 88.5,47 87.5,47 86.5,46 86.5,20.5 91.25,15.75 J5.7
N$54  (via drill 0.3)
  Top 0.152: v89.5,38 92.5,35 92.5,15 91.25,13.75 91.25,13.25 J5.8
  Bottom 0.152: v89.5,38 89.75,38.25 89.75,42 89.25,42.5 87.75,42.5 87.5,42.25 87,42.75 87,46 87.5,46.5 87.75,46.25 89.25,46.25 90,47 90,48 89.75,48.25 88.75,48.25 RN4.7
N$55  (via drill 0.3)
  Top 0.152: v75,33.5 75.75,34.25 76.25,34.25 83.25,27.25 84.5,27.25 88.5,23.25 88.5,13 91,10.5 J5.9
  Bottom 0.152: v75,33.5 75.5,34 75.5,45.25 79.75,49.5 88.5,49.5 RN4.8
N$56
  Top 0.508: J2.2 IC11.15
N$57
  Top 0.508: J2.3 IC11.14
N$58
  Top 0.508: J2.4 IC11.13
N$59
  Top 0.508: J2.5 IC11.12
N$60
  Top 0.508: J2.6 IC11.11
N$61
  Top 0.508: J2.7 IC11.10
N$62
  Top 0.508: J2.8 IC11.9
N$63
  Top 0.508: IC11.4 J1.4
N$64
  Top 0.152: PAD9.1 PAD10.1
N$65
  Top 0.152: PAD11.1 PAD12.1
N$66
  Bottom 0.152: IC7.4 100,44 97.5,44 96.5,43 95.5,43 RN4.14
N$67
  Top 0.508: J1.5 IC11.5
N$68
  Bottom 0.152: IC7.3 100,43.5 98.5,43.5 96.75,41.75 95.5,41.75 RN4.15
N$69
  Top 0.508: J1.7 IC11.7
N$71
  Bottom 0.152: IC7.2 100,42.75 99,42.75 96.75,40.5 95.5,40.5 RN4.16
N$72
  Bottom 0.152: IC7.1 100.25,42 100.25,40.75 91.25,31.75 91.25,31 J5.1
N$73
  Bottom 0.152: IC7.6 100,45.5 95.5,45.5 RN4.12
N$74
  Bottom 0.152: IC7.7 100,46 97.5,46 96.5,47 95.5,47 RN4.11
N$75
  Bottom 0.152: IC7.8 100,46.75 98.25,46.75 96.75,48.25 95.5,48.25 RN4.10
N$76
  Bottom 0.152: IC7.9 100,47.25 98.75,47.25 97,49 97,49.25 96.75,49.5 95.5,49.5 RN4.9
N$77
  Bottom 0.152: RN5.2 116.5,41.75 115.25,41.75 115,41.5 115,34.25 120.25,29 120.25,27.75 121.5,26.5 121.5,26 J7.3
N$78  (via drill 0.3)
  Top 0.152: v122,33.25 124,31.25 124,23.25 v123.5,22.75
  Bottom 0.152: v122,33.25 121,34.25 121,41 117.75,44.25 116.75,44.25 RN5.4 | v123.5,22.75 121.75,21 J7.5
N$79
  Bottom 0.152: IC8.5 128,44.75 125,44.75 124.5,44.25 123.5,44.25 RN5.13
N$80
  Bottom 0.152: IC8.4 128,44 125.5,44 124.5,43 123.5,43 RN5.14
N$81
  Bottom 0.152: IC8.3 128,43.5 126.5,43.5 124.75,41.75 123.5,41.75 RN5.15
N$82
  Bottom 0.152: IC8.2 128,42.75 127,42.75 124.75,40.5 123.5,40.5 RN5.16
N$83
  Bottom 0.152: IC8.6 128,45.5 123.5,45.5 RN5.12
N$84
  Bottom 0.152: IC8.7 128,46 125.5,46 124.5,47 123.5,47 RN5.11
N$85
  Bottom 0.152: IC8.8 128,46.75 126.25,46.75 124.75,48.25 123.5,48.25 RN5.10
N$87
  Bottom 0.152: IC8.9 128,47.25 126.75,47.25 125,49 125,49.25 124.75,49.5 123.5,49.5 RN5.9
N$88
  Bottom 0.152: IC8.1 128.25,42 128.25,38.25 121.75,31.75 121.75,31 J7.1
N$89
  Bottom 0.152: RN5.3 116.75,43.25 118,43.25 120.25,41 120.25,30.25 120.75,29.75 121.75,29.75 122,29.5 122.25,29.75 122.5,29.75 123.25,29 123.25,25 121.75,23.5 J7.4
N$90  (via drill 0.3)
  Top 0.152: v122,34.25 124.5,31.75 v124.5,22.75
  Bottom 0.152: v122,34.25 121.5,34.75 121.5,41.75 117.75,45.5 116.75,45.5 RN5.5 | v124.5,22.75 124.5,21.5 122.5,19.5 122.25,19.5 121.75,19 J7.6
N$91  (via drill 0.3)
  Top 0.152: v110,44 v112,46
  Bottom 0.152: v112,46 113,47 116.5,47 RN5.6 | v110,44 110,43.5 111,42.5 111,37.75 119.75,29 119.75,18 121.5,16.25 121.5,15.75 J7.7
N$92  (via drill 0.3)
  Top 0.152: v123,34.25 123,33.75 125.5,31.25 v125.5,22.75
  Bottom 0.152: v123,34.25 122,35.25 122,41.75 118.25,45.5 118.25,45.75 117.75,46.25 117.75,47.25 118,47.5 118,48 117.75,48.25 116.75,48.25 RN5.7 | v125.5,22.75 125.5,17.25 121.5,13.25 J7.8
N$93  (via drill 0.3)
  Top 0.152: v115,47.75 115,45.25 114.5,44.75 112.5,44.75 111.75,44 v111.75,38 | v114.1,35.65 114.1,35.6 110,31.5 v110,22.75
  Bottom 0.152: v115,47.75 115,49.25 115.25,49.5 116.5,49.5 RN5.8 | v114.1,35.65 v111.75,38 | v110,22.75 121.5,11.25 121.5,10.75 J7.9
N$94
  Top 1.016: R1.1 6.95,56.55 8.4,58 8.4,66.8 5.76,69.44 PAD15.1
N$95
  Top 1.016: R1.2 9.45,45.35 9.5,45.3 | PAD17.1 13.88,40.92 9.5,45.3 | PAD16.1 4.34,40.14 9.5,45.3
N$96
  Top 0.152: PAD8.1 R2.1
N$97
  Top 0.152: PAD7.1 R3.1
PPU_/A13_IN  (via drill 0.3)
  Top 0.152: IC5.12 142.75,22.25 146.75,22.25 159.5,35 159.5,41.5 158,43 J9.4 | v101,74.75 v97.25,74.75 | v121.25,77.75 121.25,77.25 126.25,72.25 126.25,70.5 128.75,68 v130,68
  Bottom 0.152: v97.25,74.75 89.25,74.75 83.5,69 64.75,69 60.5,73.25 60.25,73.25 J10.26 | v101,74.75 101.5,74.75 103.47,76.72 109.53,76.72 110.7,77.9 113.2,77.9 113.8,78.5 115,78.5 115.25,78.75 115.75,78.75 116.25,78.25 120.75,78.25 v121.25,77.75 | v130,68 130,67.5 152.8,44.7 153.6,44.7 154.1,45.2 154.1,46.35 155,47.25 156,47.25 156.75,46.5 156.75,44.75 158.25,43.25 J9.4
PPU_/A13_SRAM  (via drill 0.3)
  Top 0.152: v137.5,40.75 137.5,25 IC5.1 | v135.25,44.75 134.25,44.75 133.75,45.25 | 133.75,45.25 133.5,45.5 132.5,45.5 IC3.5 | v76.25,47.75 74,45.5 71.5,45.5 IC4.5 | v137,52.5 137,48.5 133.75,45.25
  Bottom 0.152: v137.5,40.75 137.5,42.5 v135.25,44.75 | v76.25,47.75 98.75,70.25 98.75,71.5 99.25,72 100.5,72 101.25,72.75 101.25,74 103.5,76.25 120.25,76.25 137,59.5 v137,52.5 137,52 160.75,28.25 188.75,28.25 PAD4.1
PPU_/RD_IN  (via drill 0.3)
  Top 0.152: v51.75,33.5 47.5,37.75 29,37.75 28.5,38.25 28.25,38.25 28,38.5 28,40.25 28.25,40.5 29,40.5 IC2.5 | v69.65,18.05 70.05,18.05 72.75,20.75 72.75,33.25 v79.5,40 | v81.25,39.5 91.25,39.5 92.25,40.5 93,40.5 IC1.5 | v172,19 PAD13.1 | v71.5,4.25 69.25,6.5 v69.25,7
  Bottom 0.152: v51.75,33.5 63.25,22 63.25,20.25 65.45,18.05 v69.65,18.05 69.65,7.4 v69.25,7 | v79.5,40 80.75,40 v81.25,39.5 | v172,19 146,19 131.25,4.25 v71.5,4.25
PPU_A12  (via drill 0.3)
  Top 0.152: 104.5,18.75 106.25,20.5 107,20.5 IC16.5 | 104.5,18.75 100.25,14.5 99.5,14.5 99.25,14.25 98.75,14.25 98.5,14.5 98.25,14.5 93.25,9.5 91.25,9.5 91,9.25 90.75,9.5 90.25,9.5 87.75,7 82.75,7 80.25,9.5 69.25,9.5 60.5,18.25 60.25,18.25 59.5,19 59.5,20.25 60,20.75 61,20.75 IC17.5 | PAD20.1 187.5,6.5 133.25,6.5 131.25,4.5 118.75,4.5 v113.35,9.9 | 104.5,18.75 v104.75,18.5
  Bottom 0.152: v104.75,18.5 v113.35,9.9
PPU_A13_IN  (via drill 0.3)
  Top 0.152: v147,23.5 142.75,23.5 IC5.13
  Bottom 0.152: v147,23.5 189.5,23.5 PAD6.1
PPU_A13_LS139  (via drill 0.3)
  Top 0.152: v138.25,25.75 138.5,25.5 138.5,24 138.25,23.75 137.5,23.75 IC5.2 | v151.25,25.75 151.25,26.25 165.75,40.75 189.75,40.75 PAD5.1
  Bottom 0.152: v151.25,25.75 v138.25,25.75
S0_CIRAM  (via drill 0.3)
  Top 0.152: v73.75,50.25 73.75,47.75 72.75,46.75 71.5,46.75 IC4.4 | v80.25,56.75 v76.75,53.25 | v98.25,72 100.5,72 101.25,72.75 101.25,74 105.75,78.5 115,78.5 115.25,78.75 115.75,78.75 119.25,75.25 v122.25,75.25
  Bottom 0.152: v76.75,53.25 v73.75,50.25 | v80.25,56.75 93.5,70 93.5,71.25 94.25,72 v98.25,72 | v122.25,75.25 122.25,74.75 153,44 154.5,44 155.5,43 J9.3
S0_IRQ  (via drill 0.3)
  Top 0.152: RN1.1 56,58.5 55.25,58.5 50.75,54 50.75,48.25 52.5,46.5 53.25,46.5 IC10.4 53.5,46.5 54.5,46.5 v55,47 | v135.8,64.6 134.95,64.6 126.05,55.7 v126.05,55.5 | v100.25,61 99.5,61.75 v98,61.75 | v71.45,57.5 v87,57.5
  Bottom 0.152: v135.8,64.6 139.4,64.6 158,46 158,45.75 J9.2 | v126.05,55.5 116.75,55.5 110.5,49.25 109.75,49.25 100.25,58.75 v100.25,61 | v98,61.75 91.25,61.75 v87,57.5 | v71.45,57.5 62.75,57.5 56.48,51.22 56.48,50.17 55.5,49.2 55.5,47.5 v55,47
S0_M2  (via drill 0.3)
  Top 0.152: v32.5,58.25 32.5,58 33.75,56.75 34.75,56.75 IC13.15 | v29,58.25 28.25,58.25 25.1,55.1 25.1,49.45 26.25,48.3 26.25,25.5 48.25,3.5 138.5,3.5 v140.75,5.75 | v149,14 162.75,27.75 v162.75,29
  Bottom 0.152: v29,58.25 v32.5,58.25 | v149,14 v140.75,5.75 | v162.75,29 156.75,35 156.75,44.25 155.5,45.5 J9.1
S0_PPU_/RD  (via drill 0.3)
  Top 0.152: v36.25,43.25 36.25,43 36,42.75 35,42.75 IC2.15 | v38.5,28.25 v38.5,35 | v154.75,21.75 155.25,21.75 159.25,25.75 v159.25,30.75
  Bottom 0.152: v36.25,43.25 36.25,37.25 v38.5,35 | v38.5,28.25 38.5,12.75 46.25,5 131.5,5 148.25,21.75 v154.75,21.75 | v159.25,30.75 158.75,30.75 154,35.5 154,39 155.5,40.5 J9.5
S0_PPU_A12  (via drill 0.3)
  Top 0.152: v67.75,24.25 68,24 68,23 67.75,22.75 67,22.75 IC17.15 | v70.5,6.25 71,6.25 71.25,6 107.25,6 113,11.75 122.25,11.75 122.5,12 126.25,12 128.75,9.5 130.5,9.5 135.25,14.25 v136.25,14.25 | v147,25 156.75,34.75 156.75,39 158.25,40.5 J9.6
  Bottom 0.152: v67.75,24.25 67.75,22.35 70.8,19.3 70.8,6.55 v70.5,6.25 | v147,25 v136.25,14.25
S1_CIRAM  (via drill 0.3)
  Top 0.152: v37,53.5 42,53.5 52.25,43.25 52.5,43.5 54.5,43.5 57.25,46.25 59.25,46.25 59.5,46 62,46 64,48 71.25,48 IC4.3
  Bottom 0.152: v37,53.5 37,65.75 32.25,70.5 J10.3
S1_IRQ  (via drill 0.3)
  Top 0.152: 51.25,53.75 55.25,57.75 56,57.75 RN1.2 | 51.25,53.75 51.25,49 52.5,47.75 53.25,47.75 IC10.3 | 51.25,53.75 v51.5,53.75
  Bottom 0.152: v51.5,53.75 36,69.25 36,71.5 35.5,72 31.25,72 30,73.25 J10.2
S1_M2
  Top 0.152: IC13.14 34.75,56 33.75,56 30,59.75 30,70.5 J10.1
S1_PPU_/RD  (via drill 0.3)
  Top 0.152: v37,44.75 37,43 36,42 35,42 IC2.14
  Bottom 0.152: v37,44.75 37,52.5 37.75,53.25 37.75,67 34.75,70 34.75,70.5 J10.5
S1_PPU_A12  (via drill 0.3)
  Top 0.152: v64,20.5 64,21 65.25,22.25 65.75,22.25 66,22 66.75,22 IC17.14 | v38.7,62.55 31,70.25 31,71.75 32.5,73.25 J10.4
  Bottom 0.152: v64,20.5 64,22.25 52,34.25 49.75,34.25 46.75,31.25 46.75,25.75 45.5,24.5 45.25,24.5 45,24.75 43.75,24.75 42.75,25.75 42.75,58.5 v38.7,62.55
S2_CIRAM  (via drill 0.3)
  Top 0.152: v57.25,66.75 73,51 73,49.5 72.75,49.25 71.5,49.25 IC4.2
  Bottom 0.152: v57.25,66.75 56.5,66.75 54,69.25 54,73.75 53,74.75 39,74.75 37.5,73.25 J10.8
S2_IRQ  (via drill 0.3)
  Top 0.152: RN1.3 55,57 53,55 | 53,55 52.25,54.25 52.25,51.5 51.75,51 51.75,49.75 52.5,49 53.25,49 IC10.2 | 53,55 v53.25,54.75
  Bottom 0.152: v53.25,54.75 53.25,55.5 38.25,70.5 37.5,70.5 J10.7
S2_M2
  Top 0.152: IC13.13 35,55.5 36,55.5 39.5,59 39.5,66.75 36,70.25 36,71.5 35.5,72 35.25,72 34.75,72.5 34.75,73.25 J10.6
S2_PPU_/RD  (via drill 0.3)
  Top 0.152: v48.75,45.25 45,41.5 35,41.5 IC2.13
  Bottom 0.152: v48.75,45.25 48.75,49.25 54,54.5 54,57.25 41.25,70 41.25,71.75 39.75,73.25 J10.10
S2_PPU_A12  (via drill 0.3)
  Top 0.152: v65.5,21.5 65.75,21.25 66.75,21.25 IC17.13 | v39.25,68.5 39.25,69.75 40,70.5 J10.9
  Bottom 0.152: v65.5,21.5 65.5,23 65,23.5 65,27 48,44 48,49.25 52.25,53.5 52.25,55.5 v39.25,68.5
S3_CIRAM  (via drill 0.3)
  Top 0.152: v57.25,61.75 58,61.75 69.25,50.5 71.25,50.5 IC4.1
  Bottom 0.152: v57.25,61.75 57.25,62.25 50.25,69.25 49.75,69.25 48.75,70.25 48.75,71.5 48.25,72 46.5,72 45,70.5 J10.13
S3_IRQ  (via drill 0.3)
  Top 0.152: RN1.4 56,56.25 55.35,56.25 54.9,55.8 v54.7,55.8 54,55.1 54,50.75 53.5,50.25 IC10.1
  Bottom 0.152: v54.7,55.8 54.7,55.9 54.5,56.1 54.5,57.25 43.75,68 43.75,71.75 42.5,73 42.5,73.25 J10.12
S3_M2
  Top 0.152: IC13.12 35,54.75 36,54.75 41.75,60.5 41.75,69.75 42.5,70.5 J10.11
S3_PPU_/RD  (via drill 0.3)
  Top 0.152: v48.75,44.25 45.25,40.75 35,40.75 IC2.12
  Bottom 0.152: v48.75,44.25 54.5,50 54.5,52.5 55.7,53.69 55.7,55.63 55.75,55.68 55.75,61.75 47.75,69.75 47.75,70.5 J10.15
S3_PPU_A12  (via drill 0.3)
  Top 0.152: v56,52.75 56,47.7 v56.4,47.3 | v50,68.5 50,69 49.05,69.95 49.05,73.7 48,74.75 46.75,74.75 45.5,73.5 45,73.5 J10.14 | IC17.12 67,20.75 67.75,20.75 68.5,21.5 68.5,24.6 67.8,25.3 67.8,28.8 65.75,30.85 v65.75,31.75
  Bottom 0.152: v65.75,31.75 65.75,32.25 54.25,43.75 54.25,45.15 55.1,46 55.9,46 56.4,46.5 v56.4,47.3 | v56,52.75 56,55.5 56.25,55.75 56.25,62.25 v50,68.5
S4_CIRAM
  Top 0.152: IC4.15 78.5,49.25 76.5,49.25 59,66.75 59,73.75 58,74.75 51.75,74.75 50.25,73.25 J10.18
S4_IRQ  (via drill 0.3)
  Top 0.152: 59,57.75 61,57.75 65,53.75 65,52.25 62,49.25 60.75,49.25 IC10.15 | 59,57.75 58,57.75 RN1.9 | 59,57.75 v59,58
  Bottom 0.152: v59,58 59,61 50.25,69.75 50.25,70.5 J10.17
S4_M2
  Top 0.152: IC13.11 35,54 36,54 46.25,64.25 46.25,71.75 47.75,73.25 J10.16
S4_PPU_/RD  (via drill 0.3)
  Top 0.152: v49.75,44.25 45.5,40 35,40 IC2.11
  Bottom 0.152: v49.75,44.25 49.75,44.75 55,50 55,50.75 59.75,55.5 59.75,61 51.25,69.5 51.25,72.25 52.5,73.5 J10.20
S4_PPU_A12  (via drill 0.3)
  Top 0.152: v68.25,20.25 68,20 67,20 IC17.11 | v51.25,45.25 51.25,47.25 50.25,48.25 50.25,62 v55,66.75
  Bottom 0.152: v68.25,20.25 68.25,20.75 65.5,23.5 65.5,31 v51.25,45.25 | v55,66.75 55,67.5 52.5,70 52.5,70.5 J10.19
S5_CIRAM
  Top 0.152: IC4.14 78.5,48 77.25,48 57,68.25 57,69.75 57.75,70.5 J10.23
S5_IRQ
  Top 0.152: J10.22 55.25,73.5 56.5,72.25 56.5,61.5 57.2,60.8 58.45,60.8 60,59.25 | 60,59.25 60.12,59.12 65.5,53.75 65.5,51.5 62,48 60.75,48 IC10.14 | 60,59.25 57.2,59.25 57.2,57.44 57.51,57.13 | RN1.8 57.64,57 57.51,57.13 | 57.51,57.13
S5_M2
  Top 0.152: IC13.10 35,53.5 36,53.5 49.4,66.9 50.5,66.9 52.85,69.25 53.5,69.25 55,70.75 J10.21
S5_PPU_/RD  (via drill 0.3)
  Top 0.152: v37.75,39.25 37.5,39.5 35,39.5 IC2.10 | v55.75,68.5 v42,54.75
  Bottom 0.152: v37.75,39.25 37.75,50.5 v42,54.75 | v55.75,68.5 57.75,68.5 60,70.75 J10.25
S5_PPU_A12  (via drill 0.3)
  Top 0.152: v65,20.75 65,20.25 65.75,19.5 66.75,19.5 IC17.10 | v55.75,69.5 55.55,69.5 v43.65,57.6
  Bottom 0.152: v65,20.75 64.5,21.25 64.5,27 43.65,47.85 v43.65,57.6 | v55.75,69.5 56.5,70.25 56.5,72.25 57.5,73.25 J10.24
S6_CIRAM
  Top 0.152: IC4.13 78.75,46.75 80.5,46.75 90.75,57 90.75,69 92.25,70.5 J11.3
S6_IRQ  (via drill 0.3)
  Top 0.152: v59.25,51.5 59.25,55.75 58.75,56.25 58,56.25 RN1.7 | v59,47 59.5,46.5 60.5,46.5 IC10.13
  Bottom 0.152: v59,47 59.25,47.25 v59.25,51.5 63.55,55.8 72.05,55.8 89.5,73.25 89.75,73.25 J11.2
S6_M2
  Top 0.152: IC13.9 34.75,52.75 33.75,52.75 31.75,54.75 31.75,57.5 28.75,60.5 28.75,69.5 28.5,69.75 28.5,71.75 28.75,72 30.5,72 31,72.5 31,73.75 32.5,75.25 84.5,75.25 89,70.75 89.75,70.75 J11.1
S6_PPU_/RD  (via drill 0.3)
  Top 0.152: v33.5,42 33.5,39 33.75,38.75 34.75,38.75 IC2.9 | v28.5,73 28.5,74 30.25,75.75 91.75,75.75 93.8,73.7 93.8,71.45 94.75,70.5 J11.5
  Bottom 0.152: v33.5,42 33.5,49.75 28.25,55 28.25,68.5 28.75,69 28.75,69.5 28.5,69.75 v28.5,73
S6_PPU_A12  (via drill 0.3)
  Top 0.152: v68.9,34.35 69,34.35 69,19.5 68,18.5 67.75,18.75 67,18.75 IC17.9 | v67,39.5 v67,36.25 | v67,43.5 72.5,43.5 76,47 77.25,47 77.5,47.25 79.5,47.25 88.25,56 89.25,56 90.25,57 90.25,69 91,69.75 91,71.75 92.5,73.25 J11.4
  Bottom 0.152: v67,36.25 v68.9,34.35 | v67,43.5 v67,39.5
S7_CIRAM
  Top 0.152: IC4.12 78.75,45.5 80,45.5 91.25,56.75 91.25,65.25 96,70 96,71.25 96.75,72 97,72 97.5,72.5 97.5,73.25 J11.8
S7_IRQ  (via drill 0.3)
  Top 0.152: v58.5,52.25 58,52.75 58,55.5 RN1.6 | v59,45.5 60.5,45.5 IC10.12
  Bottom 0.152: v58.5,52.25 58.5,47.5 58.25,47.25 58.25,46.25 58.75,45.75 | v59,45.5 58.75,45.75 | 58.75,45.75 59.75,46.75 59.75,48.75 65.5,54.5 80.5,54.5 96.75,70.75 97.25,70.75 J11.7
S7_M2  (via drill 0.3)
  Top 0.152: v29,51.75 29.5,51.75 30.5,52.75 30.5,53.25 30.25,53.5 29.25,53.5 IC13.7 | v28,69.25 28,72.5 27.75,72.75 27.75,73.75 30.25,76.25 91.75,76.25 94.75,73.25 J11.6
  Bottom 0.152: v29,51.75 29,53.75 27.75,55 27.75,69 v28,69.25
S7_PPU_/RD  (via drill 0.3)
  Top 0.152: v30.9,39.1 30.5,39.5 29.25,39.5 IC2.7 | v30.5,37 v33,37
  Bottom 0.152: v33,37 v30.9,39.1 | v30.5,37 30.5,37.5 26.75,41.25 26.75,49.5 26.25,50 26.2,50 26.2,52.95 26.75,53.5 26.75,72.75 29.75,75.75 97.25,75.75 99.75,73.25 J11.10
S7_PPU_A12  (via drill 0.3)
  Top 0.152: v69.75,32.25 69.75,19.75 67.75,17.75 66,17.75 64.25,19.5 61.25,19.5 IC17.7 | v96.75,69.25 98.25,69.25 99.75,70.75 J11.9
  Bottom 0.152: v69.75,32.25 69.25,32.25 61.25,40.25 61.25,40.75 61.75,41.25 63.75,41.25 64,41.5 64,47.25 63.5,47.75 63.25,47.5 61.75,47.5 61.25,48 61.25,48.25 61,48.5 61,49.5 65.5,54 81.5,54 v96.75,69.25
S8_CIRAM  (via drill 0.3)
  Top 0.152: v131,47 131.25,46.75 132.25,46.75 IC3.4
  Bottom 0.152: v131,47 131.75,47.75 131.75,60 121.5,70.25 121.5,74 120.25,75.25 107.75,75.25 106.25,73.75 106.25,71.75 105,70.5 J11.13
S8_IRQ  (via drill 0.3)
  Top 0.152: 113.5,56.75 110.75,54 110.75,48.25 112.5,46.5 113.25,46.5 IC9.4 | 113.5,56.75 115.25,58.5 116,58.5 RN2.1 | v110.75,58.65 111.55,58.65 113.45,56.75 113.5,56.75
  Bottom 0.152: v110.75,58.65 111,58.9 111,62.75 103.75,70 103.75,71.75 102.5,73 102.5,73.25 J11.12
S8_M2
  Top 0.152: IC12.15 99,56.75 101,56.75 103.5,59.25 103.5,69.5 102.5,70.5 J11.11
S8_PPU_/RD  (via drill 0.3)
  Top 0.152: v96.25,39 95.45,39.8 95.45,40.45 97.75,42.75 98.75,42.75 IC1.15 | v105,67.75 106.75,69.5 106.75,69.75 107.5,70.5 J11.15
  Bottom 0.152: v96.25,39 94.9,39 92.25,41.65 92.25,48.05 91,49.3 91,53.75 93.28,56.03 93.28,57.58 96.17,60.47 97.72,60.47 v105,67.75
S8_PPU_A12  (via drill 0.3)
  Top 0.152: v127.5,36.5 122.75,36.5 119.75,33.5 119.75,28.5 114,22.75 113,22.75 IC16.15 | v128,35 130.5,35 v136.75,28.75
  Bottom 0.152: v127.5,36.5 127.5,35.5 v128,35 | v136.75,28.75 142.25,34.25 142.25,45.75 132.75,55.25 132.75,61.75 122,72.5 122,74 120.25,75.75 107.75,75.75 105.5,73.5 105,73.5 J11.14
S9_CIRAM  (via drill 0.3)
  Top 0.152: v130,47.95 130,48 132.25,48 IC3.3
  Bottom 0.152: J11.18 110.25,73.25 111.75,74.75 118,74.75 119,73.75 119,70 130.88,58.12 130.88,53.97 130,53.1 v130,47.95
S9_IRQ  (via drill 0.3)
  Top 0.152: 112.5,55 111.25,53.75 111.25,49 112.5,47.75 113.25,47.75 IC9.3 | 112.5,55 115.25,57.75 116,57.75 RN2.2 | 112.5,55 v112.75,55
  Bottom 0.152: v112.75,55 111.5,56.25 111.5,68.5 110.25,69.75 110.25,70.5 J11.17
S9_M2
  Top 0.152: IC12.14 99,56 100.75,56 103.95,59.2 103.95,69.25 104.38,69.67 105.92,69.67 106.25,70 106.25,71.75 107.75,73.25 J11.16
S9_PPU_/RD  (via drill 0.3)
  Top 0.152: v102.75,44.75 100,42 99,42 IC1.14 | v112.25,56.75 112.25,56.55 v106.35,50.65
  Bottom 0.152: v102.75,44.75 102.75,46.5 105.85,49.6 105.85,50.15 v106.35,50.65 | v112.25,56.75 112.25,69.25 111.25,70.25 111.25,72.25 112.5,73.5 J11.20
S9_PPU_A12  (via drill 0.3)
  Top 0.152: v136.75,29.75 130.75,35.75 122.5,35.75 120.25,33.5 120.25,28.25 114,22 113,22 IC16.14 | v122.25,70.5 120.75,72 114.5,72 113.25,70.75 112.75,70.75 J11.19
  Bottom 0.152: v136.75,29.75 136.75,30.25 141.75,35.25 141.75,45.75 132.25,55.25 132.25,60.5 v122.25,70.5
S10_CIRAM
  Top 0.152: IC3.2 132.25,49.25 129.75,49.25 126.4,52.6 126.4,53.85 117,63.25 117,69.75 117.75,70.5 J11.23
S10_IRQ  (via drill 0.3)
  Top 0.152: RN2.3 115.25,57 113.5,55.25 113.5,54.25 | 113.5,54.25 113.5,52.75 111.75,51 111.75,49.75 112.5,49 113.25,49 IC9.2 | 113.5,54.25 v113.25,54.25
  Bottom 0.152: J11.22 115.16,73.21 114.2,72.25 114.2,70.2 113.33,69.33 113.33,54.33 v113.25,54.25
S10_M2
  Top 0.152: IC12.13 99,55.5 100.75,55.5 115.25,70 115.25,70.5 J11.21
S10_PPU_/RD  (via drill 0.3)
  Top 0.152: v102,43 100.5,41.5 99,41.5 IC1.13 | v104,48.75 108.75,48.75 v110,50 | v118.75,69 120.25,70.5 J11.25
  Bottom 0.152: v102,43 102,46.75 v104,48.75 | v110,50 114.5,54.5 114.5,64.75 v118.75,69
S10_PPU_A12  (via drill 0.3)
  Top 0.152: v112.25,15.5 111.5,16.25 111.5,21 111.75,21.25 112.75,21.25 IC16.13 | v122.75,72.75 120.75,74.75 119.5,74.75 118.25,73.5 117.75,73.5 J11.24
  Bottom 0.152: v112.25,15.5 121.25,6.5 130.25,6.5 135,11.25 135,18 134.4,18.6 134.4,20.1 135,20.7 135,22 137.5,24.5 137.5,29 142.75,34.25 142.75,45.75 133.25,55.25 133.25,62.25 v122.75,72.75
S11_CIRAM
  Top 0.152: IC3.1 132.5,50.5 133.75,50.5 153,69.75 152.25,70.5 J12.3
S11_IRQ  (via drill 0.3)
  Top 0.152: 114.5,55.5 114,55 114,50.75 113.5,50.25 IC9.1 | 114.5,55.5 115.25,56.25 116,56.25 RN2.4 | v129.5,55.15 130.6,56.25 132.5,56.25 149.5,73.25 149.75,73.25 J12.2 | v115.25,55 114.75,55.5 114.5,55.5
  Bottom 0.152: v129.5,55.15 128.4,56.25 116.5,56.25 v115.25,55
S11_M2  (via drill 0.3)
  Top 0.152: v118.5,60.75 118.25,60.5 108.5,60.5 102.75,54.75 99,54.75 IC12.12 | v126.05,60.75 130.5,60.75 138,68.25 v140,68.25
  Bottom 0.152: v126.05,60.75 v118.5,60.75 | v140,68.25 146.75,68.25 149,70.5 149.75,70.5 J12.1
S11_PPU_/RD  (via drill 0.3)
  Top 0.152: v105,30.25 105,35.75 100,40.75 99,40.75 IC1.12 | v119,18.25 119.75,18.25 120.9,17.1 135.15,17.1 136.25,16 138.25,16 139.5,17.25 139.5,26.45 138.5,27.45 138.5,29.75 150.15,41.4 150.15,52.65 v161,63.5
  Bottom 0.152: v105,30.25 107,30.25 116.58,20.67 117.83,20.67 119,19.5 v119,18.25 | v161,63.5 161,64.75 155,70.75 J12.5
S11_PPU_A12  (via drill 0.3)
  Top 0.152: v123.25,23.75 122.25,24.75 121.5,24.75 121.25,24.5 120.75,24.5 117,20.75 113,20.75 IC16.12 | v128.25,24 128.75,24.5 131,24.5 v135.5,29 | v138,48.5 138,54.25 153.5,69.75 153.5,72.25 152.5,73.25 J12.4
  Bottom 0.152: v123.25,23.75 128,23.75 v128.25,24 | v135.5,29 135.5,29.5 141.25,35.25 141.25,45.25 v138,48.5
S12_CIRAM
  Top 0.152: IC3.15 139.75,49.25 141,49.25 156,64.25 156,71.25 156.75,72 157,72 157.5,72.5 157.5,73.25 J12.8
S12_IRQ  (via drill 0.3)
  Top 0.152: 125,53.5 125,52.25 122,49.25 120.75,49.25 IC9.15 | 125,53.5 125,53.75 121,57.75 118,57.75 RN2.9 | v127.55,54 127.55,54.3 148,74.75 157.75,74.75 158.75,73.75 158.5,73.5 158.5,71.25 158,70.75 157.5,70.75 J12.7 | 125,53.5 v124.75,53.5
  Bottom 0.152: v127.55,54 125.25,54 v124.75,53.5
S12_M2  (via drill 0.3)
  Top 0.152: v111,77 109.5,77 106.25,73.75 106.25,72.5 105.75,72 101.75,72 101.25,71.5 101.25,70.25 97.25,66.25 97.25,54.5 97.75,54 98.75,54 IC12.11
  Bottom 0.152: v111,77 113.5,77 113.75,76.75 120.25,76.75 121,76 152,76 154.75,73.25 J12.6
S12_PPU_/RD  (via drill 0.3)
  Top 0.152: v104.6,22.15 104.25,22.5 104.25,28.8 99.4,33.65 99.4,37 100.6,38.2 100.6,39.4 100,40 99,40 IC1.11 | v120,6.75 121,6.75 121.25,6.5 131.25,6.5 141,16.25 143.75,16.25 153.75,26.25 153.75,28 159.5,33.75 v159.75,33.75
  Bottom 0.152: v120,6.75 v104.6,22.15 | v159.75,33.75 159.75,46.5 143.7,62.55 143.7,67.3 144.2,67.8 149.05,67.8 151,69.75 151,71.25 151.75,72 158.5,72 159.75,73.25 J12.10
S12_PPU_A12  (via drill 0.3)
  Top 0.152: v116,18 114,20 113,20 IC16.11 | v128.75,12 132.5,12 135.5,15 138.25,15 141.25,18 141.25,23.5 142,24.25 143.5,24.25 143.75,24 144,24 153.75,33.75 153.75,46.5 161.75,54.5 v161.75,64.25
  Bottom 0.152: v116,18 116,17.25 121.25,12 v128.75,12 | v161.75,64.25 161.75,68.75 160,70.5 J12.9
S13_CIRAM
  Top 0.152: IC3.14 139.75,48 143.5,48 164.25,68.75 164.25,69.75 165,70.5 J12.13
S13_IRQ  (via drill 0.3)
  Top 0.152: RN2.8 117.5,57 117,57.5 117,57.75 116.75,58 117,58.25 117,58.5 116.75,58.75 117.25,59.25 120,59.25 125.5,53.75 125.5,51.75 v125.25,51.5 121.5,47.75 120.75,47.75 IC9.14 | v127.75,55.5 128.25,55.5 148,75.25 159.75,75.25 161.5,73.5 162.25,73.5 J12.12
  Bottom 0.152: v127.75,55.5 127.75,55.2 128.4,54.55 128.4,53.75 126.15,51.5 v125.25,51.5
S13_M2  (via drill 0.3)
  Top 0.152: v96.5,58.25 96.75,58 96.75,54.5 97.75,53.5 98.75,53.5 IC12.10 | v105.75,67 108.75,70 108.75,73.75 112.5,77.5 v114,77.5
  Bottom 0.152: v96.5,58.25 96.5,58.75 104.75,67 v105.75,67 | v114,77.5 115,77.5 115.25,77.25 120.25,77.25 121,76.5 158.5,76.5 161.25,73.75 161.25,72.25 162.25,71.25 162.25,70.75 J12.11
S13_PPU_/RD  (via drill 0.3)
  Top 0.152: v98.25,37.75 98,37.75 97.5,38.25 97.5,39.25 97.75,39.5 98.75,39.5 IC1.10 | v108.5,49.5 v104.75,49.5 | v130.25,54.25 135.5,54.25 146.25,65 v147.25,65 | v163.5,69 v159.5,65
  Bottom 0.152: v98.25,37.75 98.25,38.25 101.5,41.5 101.5,42.5 101.25,42.75 101.25,43.25 101.5,43.5 101.5,47.25 103.75,49.5 v104.75,49.5 | v108.5,49.5 109,49.5 109.75,48.75 113.75,48.75 118,53 122.75,53 125,50.75 126.75,50.75 v130.25,54.25 | v159.5,65 v147.25,65 | v163.5,69 165.5,69 167,70.5 167.5,70.5 J12.15
S13_PPU_A12  (via drill 0.3)
  Top 0.152: v114.25,16.25 114.25,19.25 114,19.5 113,19.5 IC16.10 | v119.25,9.5 119.25,6.5 119.75,6 131.25,6 141,15.75 143.75,15.75 154.25,26.25 154.25,28 159.25,33 160,33 160.5,33.5 v160.5,34.5 | v155.1,61.1 155.1,61.6 163.75,70.25 163.75,72.25 165,73.5 J12.14
  Bottom 0.152: v114.25,16.25 119.25,11.25 v119.25,9.5 | v160.5,34.5 160.5,55.7 v155.1,61.1
S14_CIRAM
  Top 0.152: IC3.13 139.75,46.75 142.75,46.75 165.5,69.5 165.75,69.5 166.25,70 166.25,71.25 167,72 168.5,72 170,73.5 J12.18
S14_IRQ  (via drill 0.3)
  Top 0.152: v119.25,51.5 119.25,55.5 | 119.25,55.5 119.25,55.75 118.75,56.25 118,56.25 RN2.7 | v119,47 119.5,46.5 120.5,46.5 IC9.13 | v122.5,58.75 139.5,75.75 169.5,75.75 171.25,74 171.25,73.75 171.5,73.5 171.5,72 170.25,70.75 J12.17 | 119.25,55.5 v120.75,57
  Bottom 0.152: v119.25,51.5 119.25,47.25 v119,47 | v120.75,57 v122.5,58.75
S14_M2  (via drill 0.3)
  Top 0.152: v96,57.25 96,54.5 97.75,52.75 98.75,52.75 IC12.9 | v107,65.75 111.25,70 111.25,73.75 v115.5,78
  Bottom 0.152: v96,57.25 96.5,57.25 98,58.75 98,59.75 104,65.75 v107,65.75 | v115.5,78 116,78 116.25,77.75 120.25,77.75 121,77 163.5,77 167,73.5 167.5,73.5 J12.16
S14_PPU_/RD  (via drill 0.3)
  Top 0.152: v103.9,20.35 103.75,20.5 103.75,28.75 99,33.5 99,38.75 IC1.9 | v117.5,6.75 119.25,5 131.25,5 141,14.75 149.25,14.75 162,27.5 162,33.6 v167.4,39
  Bottom 0.152: v117.5,6.75 v103.9,20.35 | v167.4,39 179,50.6 179,73.75 177.5,75.25 174.75,75.25 172.75,73.25 J12.20
S14_PPU_A12  (via drill 0.3)
  Top 0.152: v111.75,13.75 113,15 113,18.75 IC16.9 | v118.5,6.75 119.75,5.5 131.25,5.5 141,15.25 149.25,15.25 161.4,27.4 v161.4,32.4
  Bottom 0.152: v111.75,13.75 118.5,7 v118.5,6.75 | v161.4,32.4 161.6,32.6 161.6,55.35 176.5,70.25 176.5,73.75 175.5,74.75 174.75,74.75 174,74 174,72.75 173.25,72 173,72 172.5,71.5 172.5,70.75 J12.19
S15_CIRAM
  Top 0.152: IC3.12 139.75,45.5 142,45.5 165.5,69 175.75,69 177.5,70.75 J12.23
S15_IRQ  (via drill 0.3)
  Top 0.152: v118.5,52.25 118,52.75 118,55.5 RN2.6 | v119,45.75 119.5,45.25 120.5,45.25 IC9.12 | v145,62.75 144.5,62.75 133.75,52 v129,52
  Bottom 0.152: v119,45.75 118.25,46.5 118.25,47.25 118.5,47.5 v118.5,52.25 119.5,52.25 120,51.75 120,51.5 120.75,50.75 124.25,50.75 124.75,50.25 126.75,50.25 128.5,52 v129,52 | v145,62.75 166.5,62.75 174,70.25 173.75,70.5 173.75,72 175,73.25 J12.22
S15_M2  (via drill 0.3)
  Top 0.152: v92.8,51.25 92.5,51.25 91.5,52.25 91.5,53.25 91.75,53.5 93,53.5 IC12.7 | v108.75,59.25 v102.75,53.25 | v117.75,61.25 v110.25,61.25 | v122.25,65.75 129,65.75 139.5,76.25 171.5,76.25 174,73.75 174,72.5 174.5,72 174.75,72 175.25,71.5 175.25,70.75 J12.21
  Bottom 0.152: v92.8,51.25 92.8,51.65 94.4,53.25 v102.75,53.25 | v108.75,59.25 108.75,59.75 v110.25,61.25 | v122.25,65.75 v117.75,61.25
S15_PPU_/RD  (via drill 0.3)
  Top 0.152: v103,24.5 100.25,27.25 98.25,27.25 93.25,32.25 93.25,35.25 94.5,36.5 94.5,39.25 94.25,39.5 93.25,39.5 IC1.7 | v121,14.5 121.25,14.5 121.5,14.25 122,14.25 122.35,14.6 134.6,14.6 135.5,15.5 138.25,15.5 140.25,17.5 140.25,28.25 140,28.5 140,29.5 139.5,30 139.5,30.25 150.85,41.6 150.85,45.7 156.55,51.4 v157.25,51.4 | v159.75,50.5 180,70.75 J12.25
  Bottom 0.152: v103,24.5 111,24.5 v121,14.5 | v159.75,50.5 158.85,51.4 v157.25,51.4
S15_PPU_A12  (via drill 0.3)
  Top 0.152: v110.75,18.75 110,19.5 107.25,19.5 IC16.7 | v114.75,14.75 118.25,18.25 118.25,18.5 119.35,19.6 135.65,19.6 v135.75,19.5 | v146,25 146,25.5 154.25,33.75 154.25,46.5 177,69.25 178,69.25 179,70.25 179,71.75 177.5,73.25 J12.24
  Bottom 0.152: v114.75,14.75 v110.75,18.75 | v135.75,19.5 140.5,19.5 v146,25
VCC  (via drill 0.3)
  Top 0.152: IC17.6 61.25,20 62.5,20 66,23.5 66.25,23.25 66.75,23.25 IC17.16 | RN2.5 116.25,55.5 116.25,53.5 119.25,50.5 120.5,50.5 IC9.16 | RN1.5 56.25,55.5 56.25,53.5 59.25,50.5 60.5,50.5 IC10.16 | 98.75,43.25 100.5,45 100.5,46 C1.2 | IC2.6 29.25,40 30.5,40 34,43.5 34.25,43.25 34.75,43.25 IC2.16 | 94.25,40 93.25,40 IC1.6 | 94.25,40 95.75,38.5 95.75,34.5 C7.2 | IC16.6 107.25,20 110.6,20 111,20.4 111,22.3 111.98,23.28 IC16.16 | 98.75,43.25 97.5,43.25 94.25,40 | 98.75,43.25 IC1.16 | 34.94,58.31 35,58.5 v35.2,58.6 | v99,59 98.94,59 | 79.11,51.89 79,52 v79,51.8 | 140.11,51.89 140,52 v140,51.8 | 142.01,27.76 142,27.75 v142.2,27.6 | 61.11,51.89 61,52 v61,51.8 | 121.11,51.89 121,52 v121,51.8 | v67,27 66.94,27
  Top 0.508: IC5.14 142.72,27.05 142.01,27.76 C5.2 | C8.2 129.68,31.7 J8.1 | C7.2 99,31.41 J6.1 | C6.2 83.76,31.56 J4.1 | C15.2 66.94,28.84 66.94,27 IC17.16 | IC2.16 34.94,44.74 v35.2,45 36.2,46 C2.2 | IC13.16 34.94,58.31 C12.2 | IC10.16 60.56,51.34 61.11,51.89 C3.2 | IC4.16 78.56,51.34 79.11,51.89 C4.2 | IC12.16 98.94,59 98.94,59.34 99.6,60 C13.2 | IC9.16 120.56,51.34 121.11,51.89 C9.2 | IC3.16 139.56,51.34 140.11,51.89 C10.2 | C16.2 111.2,31 v112.8,29.4 113,29.2 113,23.34 IC16.16
  Bottom 0.508: J6.1 99,35.14 IC7.20 | J8.1 129.68,37.82 IC8.20 | J4.1 83.76,38.25 IC6.20 | J2.1 IC11.16
  pour Route15: 20,79.7 193.7,79.7 193.7,0.3 20,0.3

## Text on the board
Top: 1
Route2: 2
Route15: 3
Bottom: 4
tNames: Carts 1 - 5 | Carts 6 - 10 | Carts 11 - 15 | To R35 56K / Closest to Modboard | AUDIO | GND | SRAM disable 4E Pin 12 | SRAM disable 4S Lifted Pin 26 | $5xxx disable 4E Pin 9 | $5xxx disable 2Y Lifted Pin 1 | 4J Lifted Pin 1 | PPU A13 4J Lifted Pin 15 | AUDIO | AUDIO | PPU /RD in 6X Pin 16 | GND | GND | Menu Cart | M2 3R Pin 9 | Cart 1 Pin 54 | Cart 14 Pin 54 | IRQ R42 | PPU /A13 4Y Lifted Pin 18 | PPU A13 In 4X Pin 13 | I2 P4 Pin 43 | I8 P4 Pin 45 | PPU A12 6V Pin 2 | 74ALS138 | Designed By: / j4m13c0 / / Special thanks to: / Lidnariq & Fiskbit | FamicomBox+ Rev 7 | Sep 2022
bNames: JLCJLCJLCJLC
tValues: Slots 6 -10 | Slots 11 - 15 | Slots 1 - 5 | JLCJLCJLCJLC